# Altium schematic sheet DataOut.SchDoc
size A2
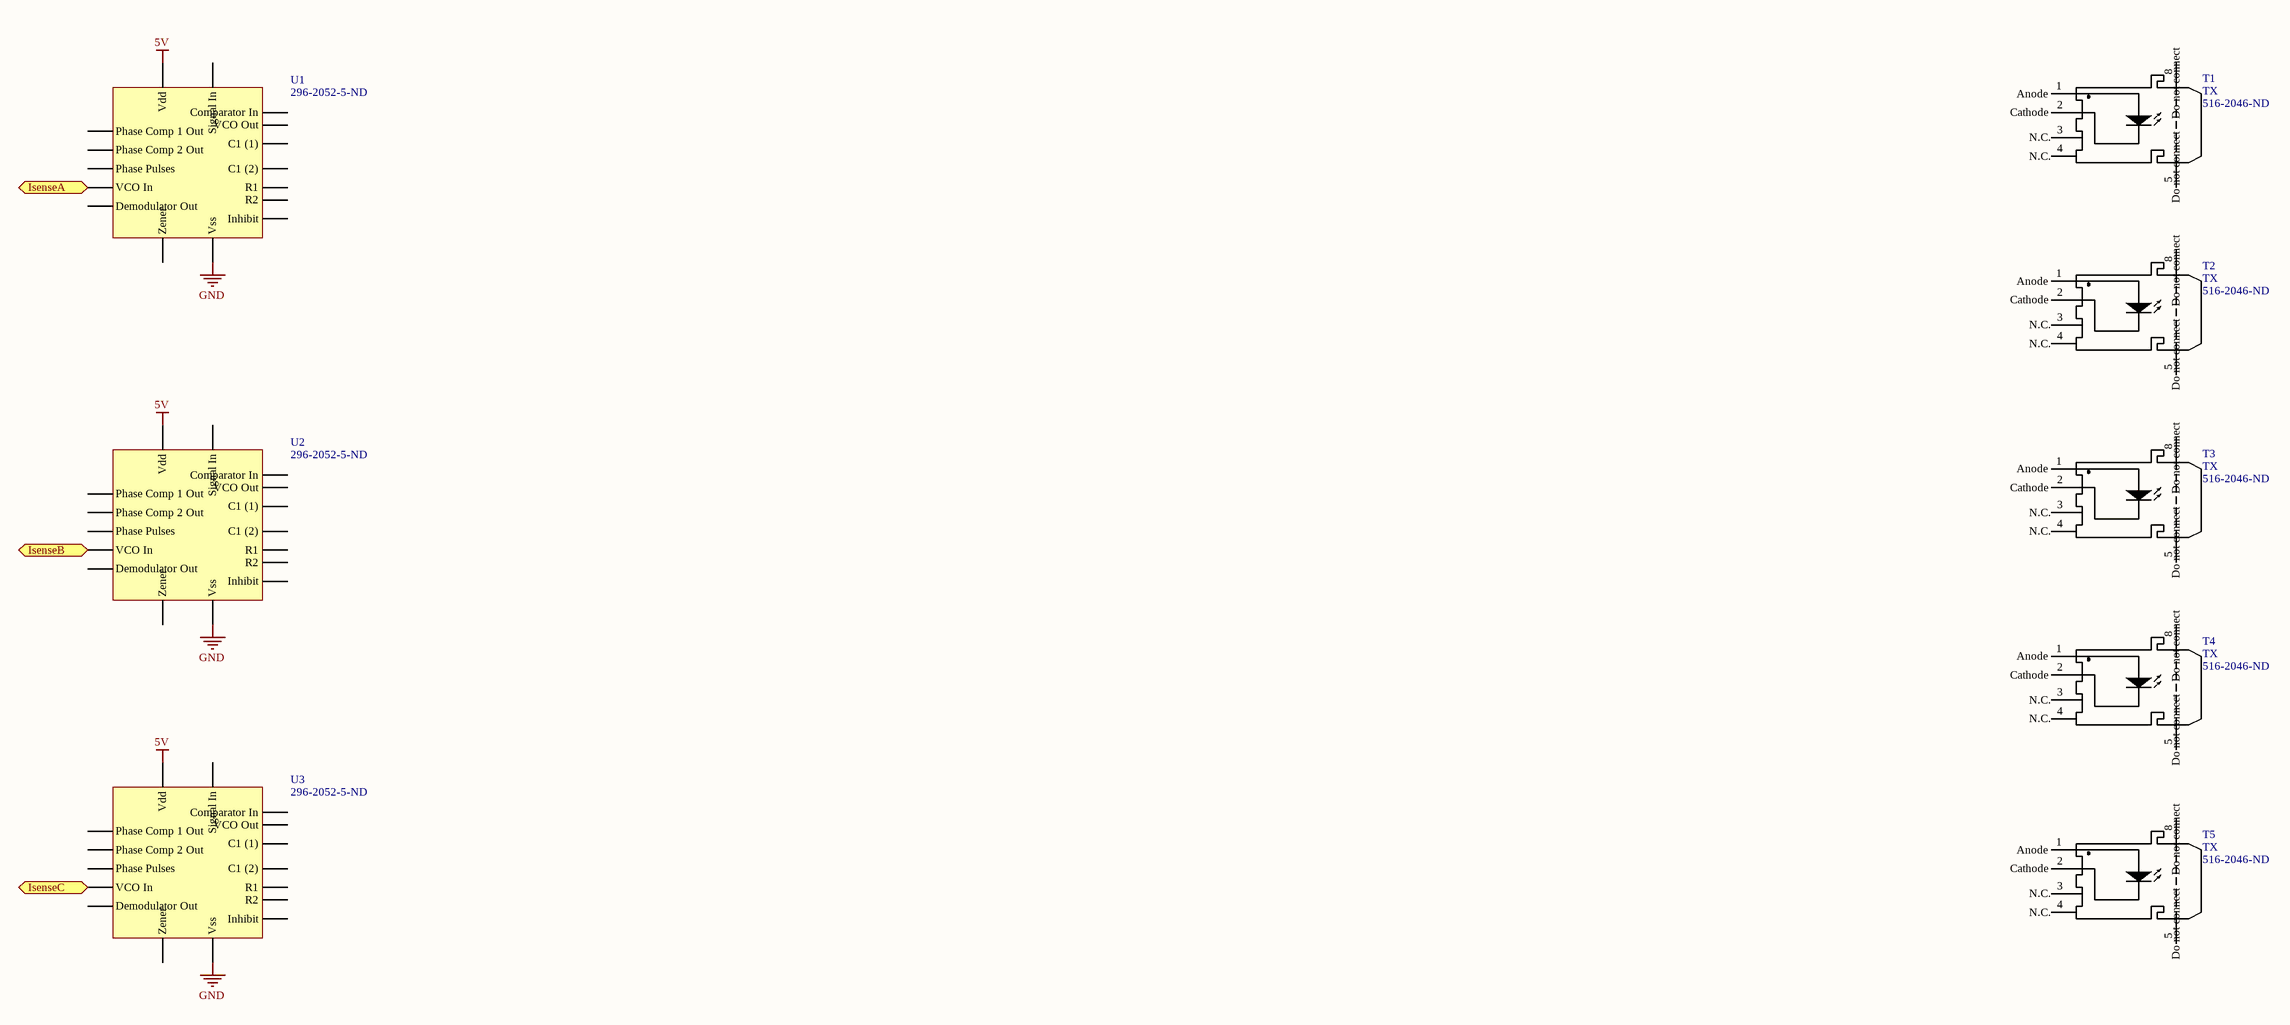
[diagram p0: DataOut.SchDoc]

## Parts
T1  TX  Supplier Part Number 1: 516-2046-ND  [Optics]
T2  TX  Supplier Part Number 1: 516-2046-ND  [Optics]
T3  TX  Supplier Part Number 1: 516-2046-ND  [Optics]
T4  TX  Supplier Part Number 1: 516-2046-ND  [Optics]
T5  TX  Supplier Part Number 1: 516-2046-ND  [Optics]
U1  Supplier Part Number 1: 296-2052-5-ND  [DIP16]  (hidden comment: CD4046B)
U2  Supplier Part Number 1: 296-2052-5-ND  [DIP16]  (hidden comment: CD4046B)
U3  Supplier Part Number 1: 296-2052-5-ND  [DIP16]  (hidden comment: CD4046B)

## Ports
IsenseA, IsenseB, IsenseC

## Nets
5V: U1.16(Vdd) U2.16(Vdd) U3.16(Vdd)
GND: U1.8(Vss) U2.8(Vss) U3.8(Vss)
IsenseA: U1.9(VCO_In) ; port IsenseA
IsenseB: U2.9(VCO_In) ; port IsenseB
IsenseC: U3.9(VCO_In) ; port IsenseC

Not connected (* = marked no-connect by the designer): T1 1(Anode) 2(Cathode) 3(N.C.) 4(N.C.) 5(Do_not_connect) 8(Do_not_connect); T2 1(Anode) 2(Cathode) 3(N.C.) 4(N.C.) 5(Do_not_connect) 8(Do_not_connect); T3 1(Anode) 2(Cathode) 3(N.C.) 4(N.C.) 5(Do_not_connect) 8(Do_not_connect); T4 1(Anode) 2(Cathode) 3(N.C.) 4(N.C.) 5(Do_not_connect) 8(Do_not_connect); T5 1(Anode) 2(Cathode) 3(N.C.) 4(N.C.) 5(Do_not_connect) 8(Do_not_connect); U1 1(Phase_Pulses) 2(Phase_Comp_1_Out) 3(Comparator_In) 4(VCO_Out) 5(Inhibit) 6(C1_(1)) 7(C1_(2)) 10(Demodulator_Out) 11(R1) 12(R2) 13(Phase_Comp_2_Out) 14(Signal_In) 15(Zener); U2 1(Phase_Pulses) 2(Phase_Comp_1_Out) 3(Comparator_In) 4(VCO_Out) 5(Inhibit) 6(C1_(1)) 7(C1_(2)) 10(Demodulator_Out) 11(R1) 12(R2) 13(Phase_Comp_2_Out) 14(Signal_In) 15(Zener); U3 1(Phase_Pulses) 2(Phase_Comp_1_Out) 3(Comparator_In) 4(VCO_Out) 5(Inhibit) 6(C1_(1)) 7(C1_(2)) 10(Demodulator_Out) 11(R1) 12(R2) 13(Phase_Comp_2_Out) 14(Signal_In) 15(Zener)

## Library data of the parts
T1-T5 = HFBR-1524Z: Otical Transmitter; Manufacturer: Broadcom Avago; Wavelength: 660nm; Capacitance: 86pF; Forward Voltage: 1.67V; Data Rate: 1Mbps; Reverse Voltage (DC): 5V; Forward Current: 80mA; Max Output Current: 5.1mA; Rise Time: 80ns; Fall Time: 40ns; Supplier 1: Digikey; Manufacturer Part Number: HFBR-1524Z; Stock 1: 1574; Pricing 1: 1=11.66, 10=10.56, 25=8.36, 100=7.04, 250=6.6, 500=6.05, 1000=5.72 (USD); Mount: Through Hole; Case/Package: 600; Number of Pins: 6; Min Operating Temperature: -40°C; Max Operating Temperature: 85°C; Package Quantity: 200; Supply Voltage: 5V; Packaging: Rail/Tube; Length: 18.8mm; Height: 7.62mm; Width: 10.2mm; Radiation Hardening: No; REACH SVHC: No SVHC; Lead Free: Lead Free; ComponentLink1URL: https://datasheet.ciiva.com/27056/2062150-27056536.pdf; ComponentLink1Description: https://datasheet.ciiva.com/27056/2062150-27056536.pdf; ComponentLink2URL: https://datasheet.ciiva.com/18408/70158101-18408620.pdf; ComponentLink2Description: https://datasheet.ciiva.com/18408/70158101-18408620.pdf; ComponentLink3URL: https://datasheet.ciiva.com/26913/hfbr-1524z-26913686.pdf; ComponentLink3Description: https://datasheet.ciiva.com/26913/hfbr-1524z-26913686.pdf
U1-U3 = CD4046B: VCO; Manufacturer: Texas Instruments; Manufacturer Part Number: CD4046BE; Max Supply Voltage: 18V; Min Supply Voltage: 3V; Number of Elements: 1; Frequency: 2.4MHz; Nominal Supply Current: 10mA; Input: CMOS; PLL: Yes; Supplier 1: Digikey; Stock 1: 1216; Pricing 1: 1=0.56, 10=0.476, 100=0.3556, 500=0.2794, 1000=0.2159 (USD); Mount: Through Hole; Case/Package: DIP; Number of Pins: 16; Weight: 0.03357oz; Contact Plating: Gold; Min Operating Temperature: -55°C; Max Operating Temperature: 125°C; Packaging: Rail/Tube; Number of Circuits: 1; Number of Bits: 1; Package Quantity: 25; Max Frequency: 2.4MHz; Radiation Hardening: No; Lead Free: Lead Free; REACH SVHC: No SVHC; ComponentLink1URL: https://datasheet.ciiva.com/14134/cd4046b-eng-tds-14134658.pdf; ComponentLink1Description: https://datasheet.ciiva.com/14134/cd4046b-eng-tds-14134658.pdf; ComponentLink2URL: https://datasheet.ciiva.com/15153/getdatasheetpartid-241639-15153402.pdf; ComponentLink2Description: https://datasheet.ciiva.com/15153/getdatasheetpartid-241639-15153402.pdf; ComponentLink3URL: https://datasheet.ciiva.com/14247/cd4046b-14247052.pdf; ComponentLink3Description: https://datasheet.ciiva.com/14247/cd4046b-14247052.pdf; ComponentLink4URL: https://datasheet.ciiva.com/26229/cd4046b-mil-26229407.pdf; ComponentLink4Description: https://datasheet.ciiva.com/26229/cd4046b-mil-26229407.pdf; ComponentLink5URL: https://datasheet.ciiva.com/27050/817951-27050191.pdf; ComponentLink5Description: https://datasheet.ciiva.com/27050/817951-27050191.pdf; ComponentLink6URL: https://datasheet.ciiva.com/29297/172880-da-01-en-c-mos-ic-cd4046be-dip16-tid-29297245.pdf; ComponentLink6Description: https://datasheet.ciiva.com/29297/172880-da-01-en-c-mos-ic-cd4046be-dip16-tid-29297245.pdf